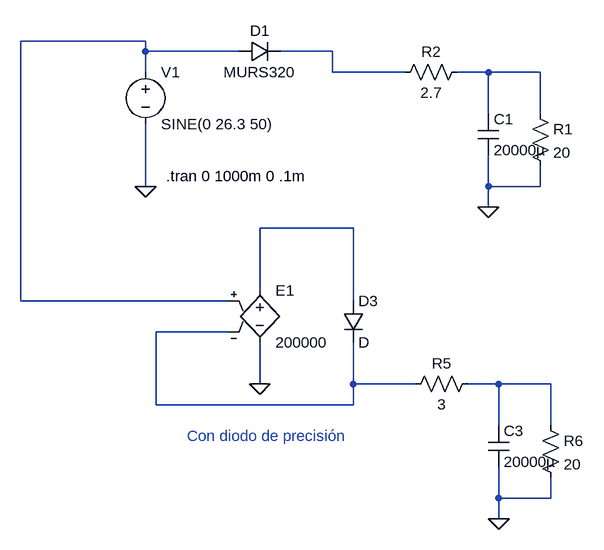
[diagram p0: schematic rectificador_mediaonda.asc]
rectificador_mediaonda.asc, the LTspice schematic file:
Version 4
SHEET 1 880 820
WIRE 64 64 -128 64
WIRE 64 80 64 64
WIRE 208 80 64 80
WIRE 352 80 272 80
WIRE 64 112 64 80
WIRE 352 112 352 80
WIRE 464 112 352 112
WIRE 592 112 544 112
WIRE 672 112 592 112
WIRE 592 176 592 112
WIRE 672 176 672 112
WIRE 64 288 64 192
WIRE 592 288 592 240
WIRE 672 288 672 256
WIRE 672 288 592 288
WIRE 592 320 592 288
WIRE 384 352 240 352
WIRE 240 448 240 352
WIRE -128 464 -128 64
WIRE 192 464 -128 464
WIRE 384 464 384 352
WIRE 192 512 80 512
WIRE 240 592 240 528
WIRE 384 592 384 528
WIRE 480 592 384 592
WIRE 608 592 560 592
WIRE 688 592 608 592
WIRE 80 624 80 512
WIRE 384 624 384 592
WIRE 384 624 80 624
WIRE 608 656 608 592
WIRE 688 656 688 592
WIRE 608 768 608 720
WIRE 688 768 688 736
WIRE 688 768 608 768
WIRE 608 800 608 768
FLAG 64 288 0
FLAG 240 592 0
FLAG 608 800 0
FLAG 592 320 0
SYMBOL voltage 64 96 R0
WINDOW 123 0 0 Left 2
WINDOW 39 0 0 Left 2
SYMATTR InstName V1
SYMATTR Value SINE(0 26.3 50)
SYMBOL e 240 432 R0
SYMATTR InstName E1
SYMATTR Value 200000
SYMBOL res 576 576 R90
WINDOW 0 0 56 VBottom 2
WINDOW 3 32 56 VTop 2
SYMATTR InstName R5
SYMATTR Value 3
SYMBOL cap 592 656 R0
SYMATTR InstName C3
SYMATTR Value 20000µ
SYMBOL res 672 640 R0
SYMATTR InstName R6
SYMATTR Value 20
SYMBOL diode 368 464 R0
SYMATTR InstName D3
SYMBOL cap 576 176 R0
SYMATTR InstName C1
SYMATTR Value 20000µ
SYMBOL res 656 160 R0
SYMATTR InstName R1
SYMATTR Value 20
SYMBOL res 560 96 R90
WINDOW 0 0 56 VBottom 2
WINDOW 3 32 56 VTop 2
SYMATTR InstName R2
SYMATTR Value 2.7
SYMBOL diode 208 96 R270
WINDOW 0 32 32 VTop 2
WINDOW 3 0 32 VBottom 2
SYMATTR InstName D1
SYMATTR Value MURS320
TEXT 96 272 Left 2 !.tran 0 1000m 0 .1m
TEXT 128 672 Left 2 ;Con diodo de precisión

The netlist it stands for:
* rectificador_mediaonda.asc
V1 N001 0 SINE(0 26.3 50)
E1 N004 0 N001 N005 200000
R5 N006 N005 3
C3 N006 0 20000µ
R6 N006 0 20
D3 N004 N005 D
C1 N003 0 20000µ
R1 N003 0 20
R2 N003 N002 2.7
D1 N001 N002 MURS320
.model D D
.lib standard.dio
.tran 0 1000m 0 .1m
* Con diodo de precisión
.backanno
.end